# EAGLE design CO2-Ampel-Pro_v12 (EAGLE 7.7.0)
Assembly variants: light

## Sheet 1 of 3
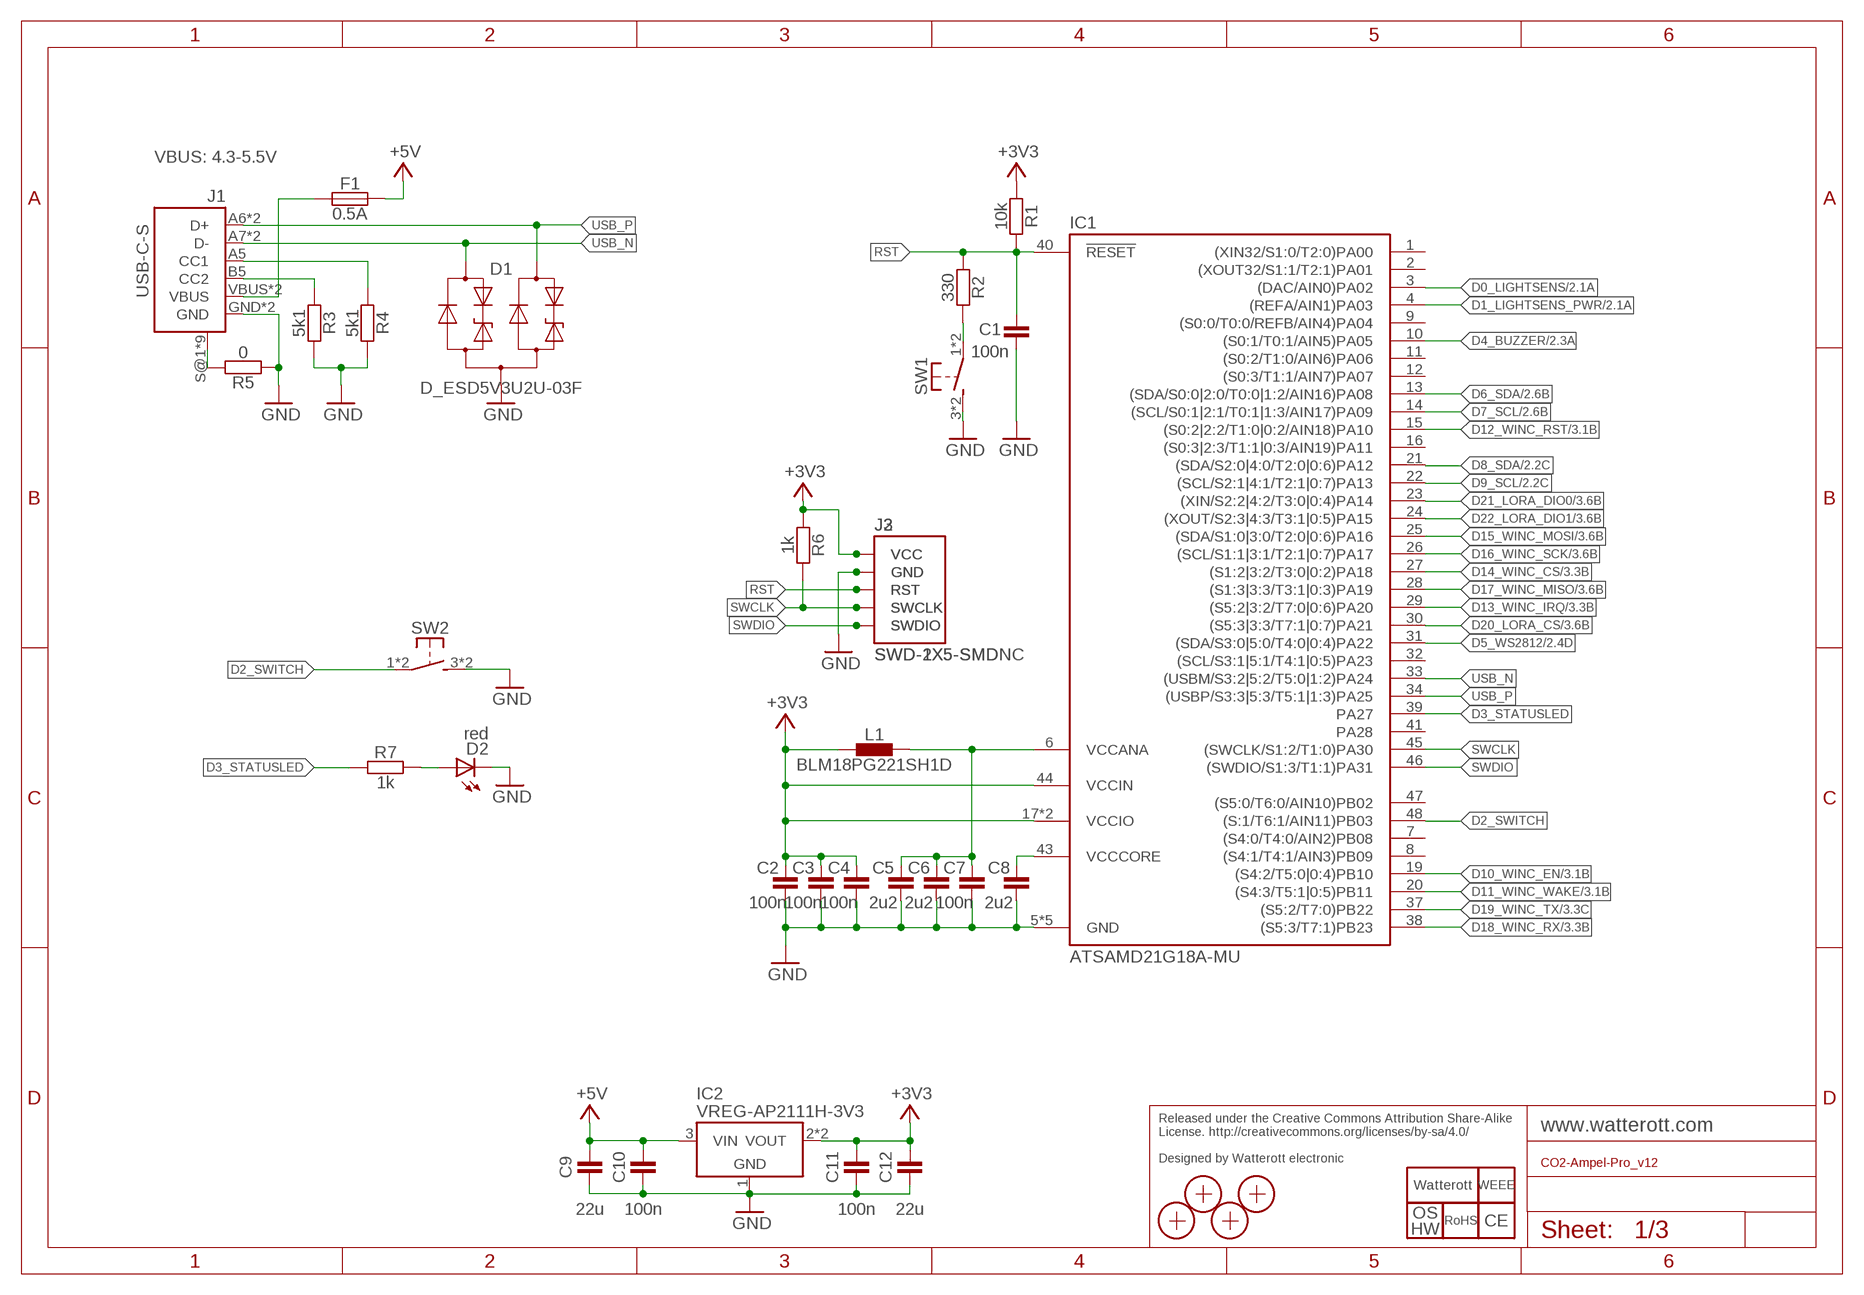
[diagram p0: schematic, sheet 1]

### Parts
C1  100n  CAPACITOR-0402  [C0402]
C2  100n  CAPACITOR-0402  [C0402]
C3  100n  CAPACITOR-0402  [C0402]
C4  100n  CAPACITOR-0402  [C0402]
C5  2u2  CAPACITOR-0402  [C0402]
C6  2u2  CAPACITOR-0402  [C0402]
C7  100n  CAPACITOR-0402  [C0402]
C8  2u2  CAPACITOR-0402  [C0402]
C9  22u  CAPACITOR-0805  [C0805]
C10  100n  CAPACITOR-0402  [C0402]
C11  100n  CAPACITOR-0402  [C0402]
C12  22u  CAPACITOR-0805  [C0805]
D1  D_ESD5V3U2U-03F  [SOT723]
D2  red  LED-0603  [C0603]
F1  0.5A  FUSE-0805  [C0805]
IC1  ATSAMD21G18A-MU  [QFN48-PAD]
IC2  VREG-AP2111H-3V3  VREG-TS1117CW-3V3  [SOT223]
J1  USB-C-S  [USB-C-S]
J2  SWD-2X5-SMD  [SWD-2X5_SMD]  (not fitted in variant light)
J3  SWD-1X5-SMDNC  [SWD-1X5_SMDNC]
L1  BLM18PG221SH1D  INDUCTOR-0603  [C0603]
LOGO1  LOGO_SPARK-4  [SPARK_4MM]
LOGO2  LOGO_WEEE-4  [WEEE_4MM]
LOGO3  OSHW_LOGOX0070  LOGO_OSHW-3  [OSHW_3MM]
LOGO4  LOGO_ROHS-4  [ROHS_4MM]
LOGO5  LOGO_CE-4  [CE_4MM]
R1  10k  RESISTOR-0402  [C0402]
R2  330  RESISTOR-0402  [C0402]
R3  5k1  RESISTOR-0402  [C0402]
R4  5k1  RESISTOR-0402  [C0402]
R5  0  RESISTOR-0603  [C0603]
R6  1k  RESISTOR-0402  [C0402]
R7  1k  RESISTOR-0402  [C0402]
SW1  PTS645SK50SMTR92-Red  SW-TACTILE-PTS840P  [PTS840P]
SW2  PTS645SH50SMTR92-Grey  SW-TACTILE-PTS840P  [PTS840P]  (not fitted in variant light)
X1  PASSER-07  [PASSER_07MM]
X2  PASSER-07  [PASSER_07MM]
X3  PASSER-07  [PASSER_07MM]
X4  PASSER-07  [PASSER_07MM]

### Nets
+3V3: C2.2 C3.2 C4.2 C11.2 C12.2 IC1.17(VCCIO) IC1.36(VCCIO) IC1.44(VCCIN) IC2.2(VOUT) IC2.4(VOUT) J2.VCC J3.1-VCC(VCC) L1.1 R1.1 R6.1 ; also sheet 2,3
+5V: C9.2 C10.2 F1.2 IC2.3(VIN) ; also sheet 2
CC1: J1.A5(CC1) R4.1
CC2: J1.B5(CC2) R3.1
D0_LIGHTSENS: IC1.3((DAC/AIN0)PA02) ; also sheet 2
D1_LIGHTSENS_PWR: IC1.4((REFA/AIN1)PA03) ; also sheet 2
D2_SWITCH: IC1.48((S:1/T6:1/AIN11)PB03) SW2.1 SW2.2(P1)
D3_STATUSLED: IC1.39(PA27) R7.1
D4_BUZZER: IC1.10((S0:1/T0:1/AIN5)PA05) ; also sheet 2
D5_WS2812: IC1.31((SDA/S3:0|5:0/T4:0|0:4)PA22) ; also sheet 2
D6_SDA: IC1.13((SDA/S0:0|2:0/T0:0|1:2/AIN16)PA08) ; also sheet 2
D7_SCL: IC1.14((SCL/S0:1|2:1/T0:1|1:3/AIN17)PA09) ; also sheet 2
D8_SDA: IC1.21((SDA/S2:0|4:0/T2:0|0:6)PA12) ; also sheet 2
D9_SCL: IC1.22((SCL/S2:1|4:1/T2:1|0:7)PA13) ; also sheet 2
D10_WINC_EN: IC1.19((S4:2/T5:0|0:4)PB10) ; also sheet 3
D11_WINC_WAKE: IC1.20((S4:3/T5:1|0:5)PB11) ; also sheet 3
D12_WINC_RST: IC1.15((S0:2|2:2/T1:0|0:2/AIN18)PA10) ; also sheet 3
D13_WINC_IRQ: IC1.29((S5:2|3:2/T7:0|0:6)PA20) ; also sheet 3
D14_WINC_CS: IC1.27((S1:2|3:2/T3:0|0:2)PA18) ; also sheet 3
D15_WINC_MOSI: IC1.25((SDA/S1:0|3:0/T2:0|0:6)PA16) ; also sheet 3
D16_WINC_SCK: IC1.26((SCL/S1:1|3:1/T2:1|0:7)PA17) ; also sheet 3
D17_WINC_MISO: IC1.28((S1:3|3:3/T3:1|0:3)PA19) ; also sheet 3
D18_WINC_RX: IC1.38((S5:3/T7:1)PB23) ; also sheet 3
D19_WINC_TX: IC1.37((S5:2/T7:0)PB22) ; also sheet 3
D20_LORA_CS: IC1.30((S5:3|3:3/T7:1|0:7)PA21) ; also sheet 3
D21_LORA_DIO0: IC1.23((XIN/S2:2|4:2/T3:0|0:4)PA14) ; also sheet 3
D22_LORA_DIO1: IC1.24((XOUT/S2:3|4:3/T3:1|0:5)PA15) ; also sheet 3
GND: C1.1 C2.1 C3.1 C4.1 C5.1 C6.1 C7.1 C8.1 C9.1 C10.1 C11.1 C12.1 D1.3(A) D2.C IC1.5(GND) IC1.18(GND) IC1.35(GND) IC1.42(GND) IC1.TP(GND) IC2.1(GND) J1.GND J1.GND2(GND) J2.GND@1(GND) J2.GND@2(GND) J2.GND@3(GND) J3.2-GND(GND) R3.2 R4.2 R5.1 SW1.3(S1) SW1.4(S1) SW2.3(S1) SW2.4(S1) ; also sheet 2,3
N$3: D2.A R7.2
N$8: R2.2 SW1.1 SW1.2(P1)
RST: C1.2 IC1.40(!RESET) J2.RST J3.3-RST(RST) R1.2 R2.1
SHLD: J1.S@1(SHIELD) J1.S@2(SHIELD) J1.S@3(SHIELD) J1.S@4(SHIELD) J1.S@5(SHIELD) J1.S@6(SHIELD) J1.S@7(SHIELD) J1.S@8(SHIELD) J1.S@9(SHIELD) R5.2
SWCLK: IC1.45((SWCLK/S1:2/T1:0)PA30) J2.SWCLK J3.4-SWDCLK(SWCLK) R6.2
SWDIO: IC1.46((SWDIO/S1:3/T1:1)PA31) J2.SWDIO J3.5-SWDIO(SWDIO)
USB_N [USB]: D1.1(C1) IC1.33((USBM/S3:2|5:2/T5:0|1:2)PA24) J1.A7(D-) J1.B7(D-)
USB_P [USB]: D1.2(C2) IC1.34((USBP/S3:3|5:3/T5:1|1:3)PA25) J1.A6(D+) J1.B6(D+)
VBUS: F1.1 J1.VBUS J1.VBUS2(VBUS)
VCCANA: C5.2 C6.2 C7.2 IC1.6(VCCANA) L1.2
VCCCORE: C8.2 IC1.43(VCCCORE)
Unconnected: IC1.1((XIN32/S1:0/T2:0)PA00) IC1.2((XOUT32/S1:1/T2:1)PA01) IC1.7((S4:0/T4:0/AIN2)PB08) IC1.8((S4:1/T4:1/AIN3)PB09) IC1.9((S0:0/T0:0/REFB/AIN4)PA04) IC1.11((S0:2/T1:0/AIN6)PA06) IC1.12((S0:3/T1:1/AIN7)PA07) IC1.16((S0:3|2:3/T1:1|0:3/AIN19)PA11) IC1.32((SCL/S3:1|5:1/T4:1|0:5)PA23) IC1.41(PA28) IC1.47((S5:0/T6:0/AIN10)PB02)

### Notes on the sheet
- VBUS: 4.3-5.5V
- Released under the Creative Commons Attribution Share-Alike
  License. http://creativecommons.org/licenses/by-sa/4.0/
  
  Designed by Watterott electronic

## Sheet 2 of 3
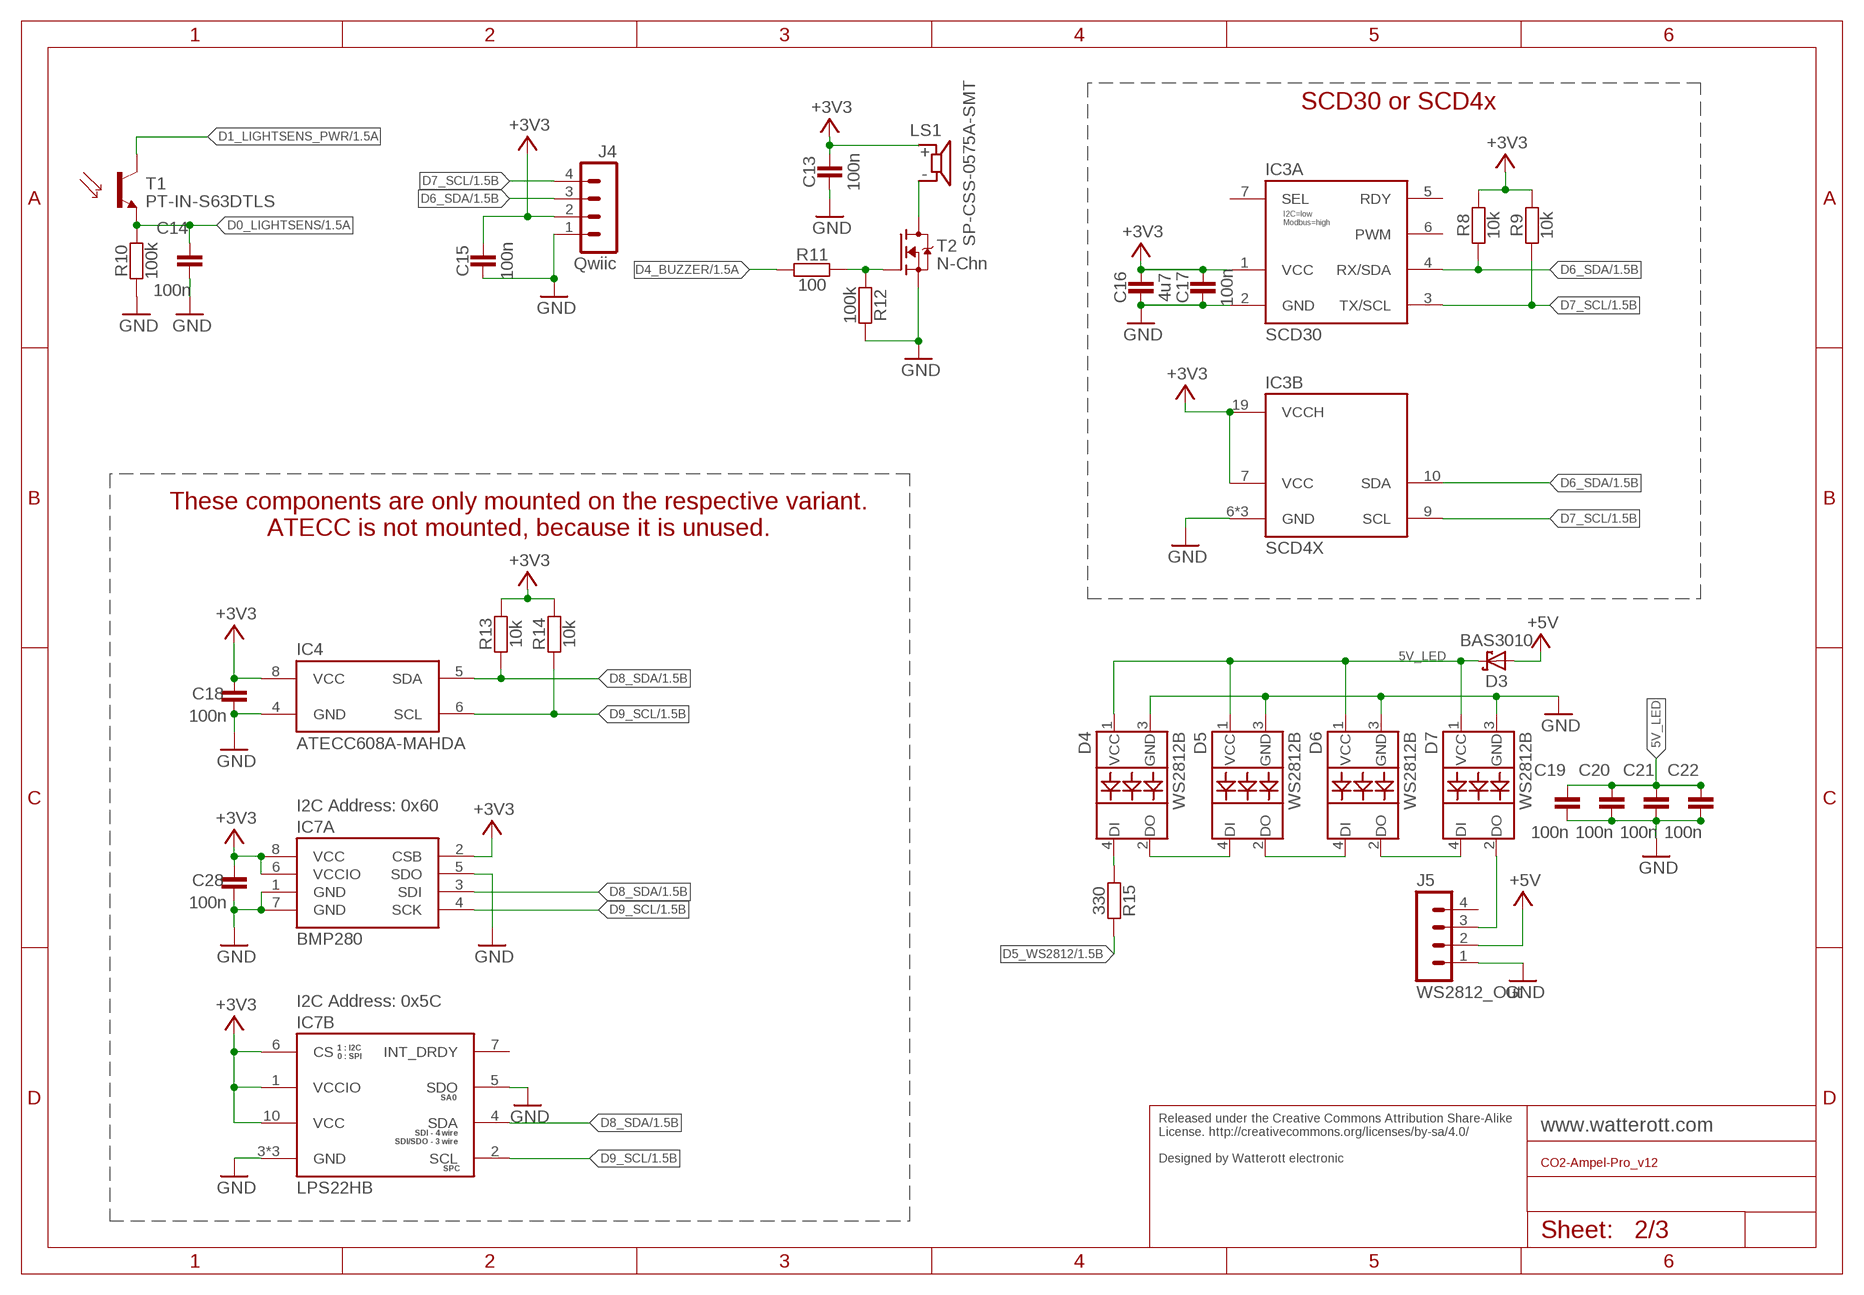
[diagram p1: schematic, sheet 2]

### Parts
C13  100n  CAPACITOR-0402  [C0402]
C14  100n  CAPACITOR-0402  [C0402]
C15  100n  CAPACITOR-0402  [C0402]
C16  4u7  CAPACITOR-0402  [C0402]
C17  100n  CAPACITOR-0402  [C0402]
C18  100n  CAPACITOR-0402  [C0402]
C19  100n  CAPACITOR-0402  [C0402]
C20  100n  CAPACITOR-0402  [C0402]
C21  100n  CAPACITOR-0402  [C0402]
C22  100n  CAPACITOR-0402  [C0402]
C28  100n  CAPACITOR-0402  [C0402]
D3  BAS3010  D_SCHOTTKY-SOD323  [SOD323]
D4  WS2812B  [WS2812B]
D5  WS2812B  [WS2812B]
D6  WS2812B  [WS2812B]
D7  WS2812B  [WS2812B]
IC3A  SCD30  [SCD30]
IC3B  SCD4X  [SCD4X]
IC4  ATECC608A-MAHDA  [UDFN8]
IC7A  BMP280  [LGA8]
IC7B  LPS22HB  [LPS22HB]
J4  Qwiic  JST4-SM04B-SRSS-TB  [JST_SM04B-SRSS-TB]
J5  WS2812_Out  JST4-SM04B-SRSS-TB  [JST_SM04B-SRSS-TB]
LS1  SP-CSS-0575A-SMT  [CUI_CSS-0575A-SMT]
R8  10k  RESISTOR-0402  [C0402]
R9  10k  RESISTOR-0402  [C0402]
R10  100k  RESISTOR-0402  [C0402]
R11  100  RESISTOR-0402  [C0402]
R12  100k  RESISTOR-0402  [C0402]
R13  10k  RESISTOR-0402  [C0402]
R14  10k  RESISTOR-0402  [C0402]
R15  330  RESISTOR-0402  [C0402]
T1  PT-IN-S63DTLS  [C0603T]
T2  N-Chn  MOSFET-N-SOT23  [SOT23]

### Nets
5V_LED: C19.2 C20.2 C21.2 C22.2 D3.C D4.1(VCC) D5.1(VCC) D6.1(VCC) D7.1(VCC)
+3V3: C13.2 C15.2 C16.2 C17.2 C18.2 C28.2 IC3A.1(VCC) IC3B.7(VCC) IC3B.19(VCCH) IC4.8(VCC) IC7A.2(CSB) IC7A.6(VCCIO) IC7A.8(VCC) IC7B.1(VCCIO) IC7B.6(CS) IC7B.10(VCC) J4.2 LS1.+(P) R8.2 R9.2 R13.2 R14.2 ; also sheet 1,3
+5V: D3.A J5.2 ; also sheet 1
D0_LIGHTSENS: C14.2 R10.2 T1.E ; also sheet 1
D1_LIGHTSENS_PWR: T1.C ; also sheet 1
D4_BUZZER: R11.1 ; also sheet 1
D5_WS2812: R15.2 ; also sheet 1
D6_SDA: IC3A.4(RX/SDA) IC3B.10(SDA) J4.3 R8.1 ; also sheet 1
D7_SCL: IC3A.3(TX/SCL) IC3B.9(SCL) J4.4 R9.1 ; also sheet 1
D8_SDA: IC4.5(SDA) IC7A.3(SDI) IC7B.4(SDA) R13.1 ; also sheet 1
D9_SCL: IC4.6(SCL) IC7A.4(SCK) IC7B.2(SCL) R14.1 ; also sheet 1
GND: C13.1 C14.1 C15.1 C16.1 C17.1 C18.1 C19.1 C20.1 C21.1 C22.1 C28.1 D4.3(GND) D5.3(GND) D6.3(GND) D7.3(GND) IC3A.2(GND) IC3B.6(GND) IC3B.20(GND) IC3B.21(GND) IC4.4(GND) IC7A.1(GND) IC7A.5(SDO) IC7A.7(GND) IC7B.3(GND) IC7B.5(SDO) IC7B.8(GND) IC7B.9(GND) J4.1 J5.1 R10.1 R12.2 T2.2(S) ; also sheet 1,3
N$1: LS1.-(N) T2.3(D)
N$2: R11.2 R12.1 T2.1(G)
W1IN: D4.4(DI) R15.1
W1OUT: D4.2(DO) D5.4(DI)
W2OUT: D5.2(DO) D6.4(DI)
W3OUT: D6.2(DO) D7.4(DI)
W4OUT: D7.2(DO) J5.3
Unconnected: IC3A.5(RDY) IC3A.6(PWM) IC3A.7(SEL) IC7B.7(INT_DRDY) J5.4

### Notes on the sheet
- SCD30 or SCD4x
- These components are only mounted on the respective variant.
  ATECC is not mounted, because it is unused.
- I2C Address: 0x60
- I2C Address: 0x5C
- Released under the Creative Commons Attribution Share-Alike
  License. http://creativecommons.org/licenses/by-sa/4.0/
  
  Designed by Watterott electronic

## Sheet 3 of 3
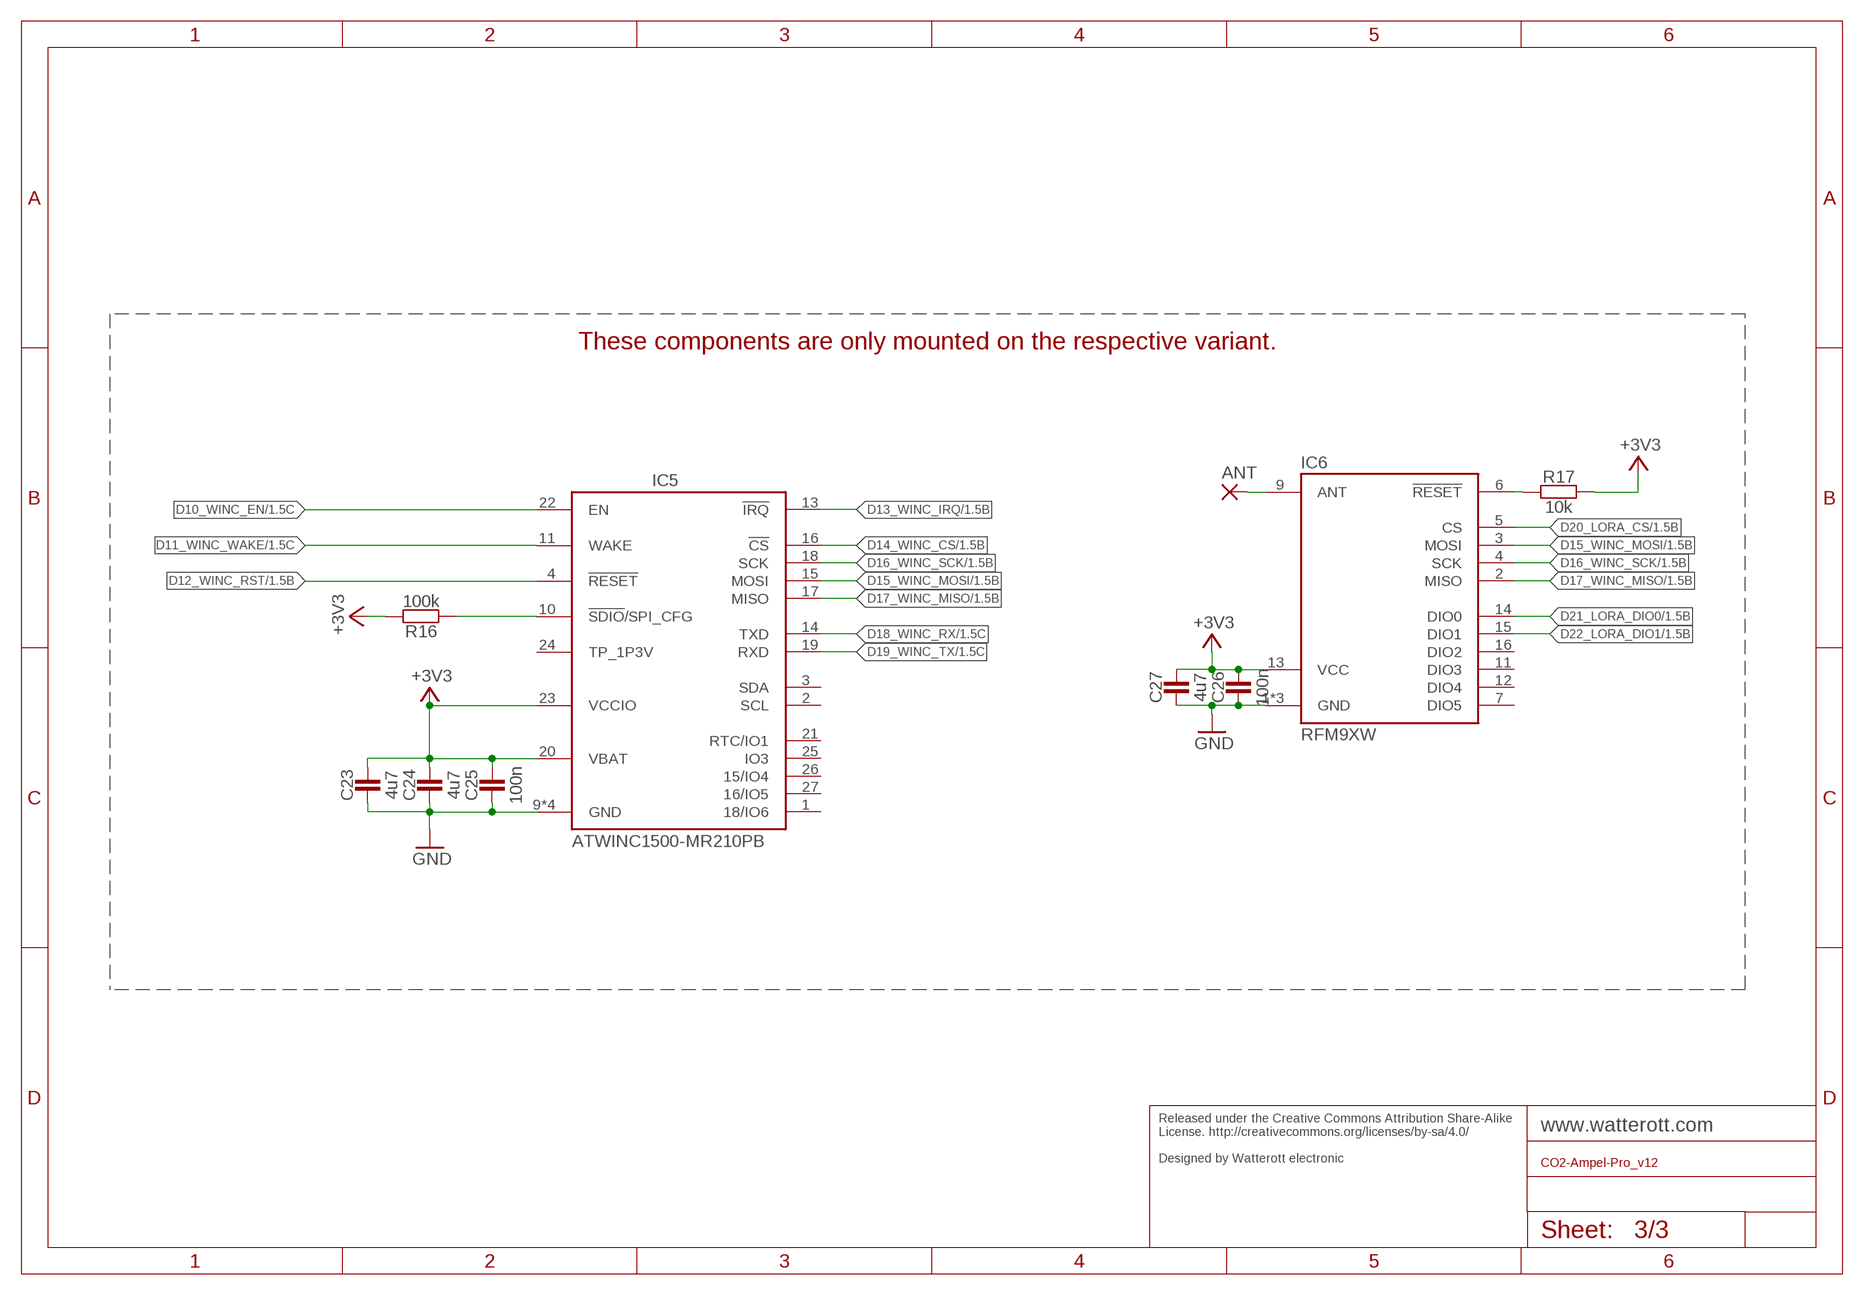
[diagram p2: schematic, sheet 3]

### Parts
ANT  1,6/0,9  [1,6/0,9]
C23  4u7  CAPACITOR-0402  [C0402]
C24  4u7  CAPACITOR-0402  [C0402]
C25  100n  CAPACITOR-0402  [C0402]
C26  100n  CAPACITOR-0402  [C0402]
C27  4u7  CAPACITOR-0402  [C0402]
IC5  ATWINC1500-MR210PB  [ATWINC1500-MX210]
IC6  RFM9XW  [RFM9X]
R16  100k  RESISTOR-0402  [C0402]
R17  10k  RESISTOR-0402  [C0402]

### Nets
+3V3: C23.2 C24.2 C25.2 C26.2 C27.2 IC5.20(VBAT) IC5.23(VCCIO) IC6.13(VCC) R16.2 R17.2 ; also sheet 1,2
CFG: IC5.10(!SDIO!/SPI_CFG) R16.1
D10_WINC_EN: IC5.22(EN) ; also sheet 1
D11_WINC_WAKE: IC5.11(WAKE) ; also sheet 1
D12_WINC_RST: IC5.4(!RESET) ; also sheet 1
D13_WINC_IRQ: IC5.13(!IRQ) ; also sheet 1
D14_WINC_CS: IC5.16(!CS) ; also sheet 1
D15_WINC_MOSI: IC5.15(MOSI) IC6.3(MOSI) ; also sheet 1
D16_WINC_SCK: IC5.18(SCK) IC6.4(SCK) ; also sheet 1
D17_WINC_MISO: IC5.17(MISO) IC6.2(MISO) ; also sheet 1
D18_WINC_RX: IC5.14(TXD) ; also sheet 1
D19_WINC_TX: IC5.19(RXD) ; also sheet 1
D20_LORA_CS: IC6.5(CS) ; also sheet 1
D21_LORA_DIO0: IC6.14(DIO0) ; also sheet 1
D22_LORA_DIO1: IC6.15(DIO1) ; also sheet 1
GND: C23.1 C24.1 C25.1 C26.1 C27.1 IC5.9(GND) IC5.12(GND) IC5.28(GND) IC5.GND IC6.1(GND) IC6.8(GND) IC6.10(GND) ; also sheet 1,2
N$4: ANT.1(P) IC6.9(ANT)
N$6: IC6.6(!RESET) R17.1
Unconnected: IC5.1(18/IO6) IC5.2(SCL) IC5.3(SDA) IC5.21(RTC/IO1) IC5.24(TP_1P3V) IC5.25(IO3) IC5.26(15/IO4) IC5.27(16/IO5) IC6.7(DIO5) IC6.11(DIO3) IC6.12(DIO4) IC6.16(DIO2)

### Notes on the sheet
- These components are only mounted on the respective variant.
- Released under the Creative Commons Attribution Share-Alike
  License. http://creativecommons.org/licenses/by-sa/4.0/
  
  Designed by Watterott electronic

## Library data of the parts
ANT = wirepad:1,6/0,9: THROUGH-HOLE PAD
C1-C28 = we-rcl:CAPACITOR: Capacitor ...2.2uF @ 6.3V -> 0402 ...4.7uF @ 6.3V -> 0603 ...10uF @ 16V -> 0805 ...22uF @ 25V -> 1206
D1 = we-rcl:D_ESD5V3U2U: ESD5V3U2U TVS Diode (Uni-directional Ultra Low ESD) Vrwm=5.3V, 0.4pF@1MHz; DIGIKEY: ESD5V3U2U-03F H6327DKR-ND
D2 = we-opto:LED: LED red, green, blue -> 0603
D3 = we-rcl@1:D_SCHOTTKY: Schottky Diode 1A, 30V - SOD323 (BAS3010B) 3A, 100V - SOD123 (S310A)
D4-D7 = we-opto:WS2812B: WS2812 RGB LED (built-in driver)
F1 = we-rcl:FUSE: Fuse Polyfuses 0805 - 0.5A or 1A, 6V 1206 - 2A, 6V 1812 - 1A or 2A, 16V
IC1 = we-chip:ATSAMD21G: Microchip ATSAMD21Gxx ARM Cortex-M0+ (48 pin) ...18 - 256kb Flash 32kb RAM ...17 - 128kb Flash 16kb RAM ...16 - 64kb Flash 8kb RAM ...15 - 32kb Flash 4kb RAM
IC2 = we-power:VREG: Voltage Regulator LDOs Taiwan Semi TS1117 800mA max 15V - compatible On Semi NCP1117 1A max 20V - compatible Diodes AP2111H 0.6A max 6V (0.25V@0.6A) - compatible Diodes AP2114H 1A max 6V (0.45V@1A) Taiwan Semi TS9011 250mA max 12V - compatible Diodes AP2210 300mA max 15V - compatible Microchip MCP1700 250mA max 6.5V - compatible Microchip MCP1702 250mA max 13V - compatible Microchip MCP1703 250mA max 16V - compatible Microchip MCP1754 150mA max 16V Taiwan Semi TS5204 80mA max 16V (low noise) DC/DC Converter Modules Recom R-78Ex.x-1.0-W36 1A max 28V - compatible CUI V78xx-2000 2A max 18V Murata OKI-78SR-x.x/1.5-W36 1.5A max 36V
IC3A = we-sensor:SCD30: Sensirion SCD30 CO2, Humidity, Temperature Sensor
IC3B = we-sensor@1:SCD4X: Sensirion SCD4x CO2 Sensor
IC4 = we-chip:ATECC608A: Microchip ATECC508A/ATECC608A Crypto-Authentication Device ATECC508A - RNG, ECC P256 (ECDH and ECDSA), SHA256 ATECC608A - RNG, ECC P256 (ECDH and ECDSA), SHA256, AES-CCM
IC5 = we-chip:ATWINC1500: Microchip ATWINC1500 WiFi/WLAN 802.11 b/g/n MR210PB - PCB antenna MR210UB - uFL connector WINC1500 - 4Mb Flash WINC1510 - 8Mb Flash
IC6 = we-chip:RFM9X: HopeRF RFM9xW LoRa Module RFM95W 868/915 MHz (SX1276 compatible) RFM96W 433/470 MHz (SX1276 compatible)
IC7A = we-sensor@1:BMP280: Bosch BMP280 Temperature, Pressure Sensor
IC7B = we-sensor@1:LPS22HB: MEMS nano pressure sensor: 260-1260 hPa absolute
J1 = we-con:USB-C: USB-C Connector Hroparts TYPE-C-31-M-12 or Jing C167321 or XKB U262-161N-4BVC11 Up: XKB U263-241N-4BQC11-1 or Wuerth 632722110112
J2 J3 = we-board:SWD: SWD connector
J4 J5 = we-con:JST4: JST Connector
L1 = we-rcl:INDUCTOR: Inductor Ferrite Bead - Murata BLM18PG 0603 3.0A 33Ohm @ 100MH -> BLM18PG330SN1D 0603 2.0A 120Ohm @ 100MH -> BLM18PG121SN1D 0603 1.4A 220Ohm @ 100MH -> BLM18PG221SH1D 0603 1.2A 330Ohm @ 100MH -> BLM18PG331SN1D 0603 1.0A 470Ohm @ 100MH -> BLM18PG471SN1D
LOGO1 = we-symbol:LOGO_SPARK: Watterott electronic Logo
LOGO2 = we-symbol:LOGO_WEEE: WEEE Logo
LOGO3 = we-symbol:LOGO_OSHW: Open-Source-Hardware Logo
LOGO4 = we-symbol:LOGO_ROHS: RoHS Logo
LOGO5 = we-symbol:LOGO_CE: CE Logo
LS1 = we-audio:SP: Speaker/Buzzer CUI CSS-0575A-SMT (3V, 75dB); MF: CUI; MPN: CSS-0575A-SMT
R1-R17 = we-rcl:RESISTOR: Resistor all kinds in 0402 and 0603
SW1 SW2 = we-switch:SW-TACTILE: Tactile Switche; DIGIKEY: CKN10511DKR-ND
T1 = we-opto:PT: Phototransistor
T2 = we-transistor:MOSFET-N: N-Chn MOSFET SOT23 N-Chn MOSFET TSM3404, TSM240N03 (Vgs>=+/-20V, Vds<=30V, Id>=3A + Rds<=0.05Ohm @ Vgs=4.5V) BSS138 (Vgs>=+/-20V, Vds<=40V, Id>=0.2A + Rds<=3Ohm @ Vgs=4.5V) SOT223 Low Side Switch with Protection (Infineon) BSP76 (Vin=0...10V, Vds<=42V, Id=1.4A + Rds=0.2Ohm @ Vin=5V) BSP77 (Vin=0...10V, Vds<=42V, Id=2.2A + Rds=0.1Ohm @ Vin=5V) D²Pak Low Side Switch with Protection (Infineon) BTS117TC (Vin=0...10V, Vds<=60V, Id=3.5A + Rds=0.12Ohm @ Vin=5V) BTS133TC (Vin=0...10V, Vds<=60V, Id=7A + Rds=0.06Ohm @ Vin=5V) BTS141TC (Vin=0...10V, Vds<=60V, Id=12A + Rds=0.03Ohm @ Vin=5V) BTS3018TC (Vin=0...10V, Vds<=60V, Id=6A + Rds=0.02Ohm @ Vin=5V)
X1-X4 = we-symbol:PASSER: Fiducial Marker

## Net classes
1 USB: width 0.203 mm, clearance 0.152 mm

## Board
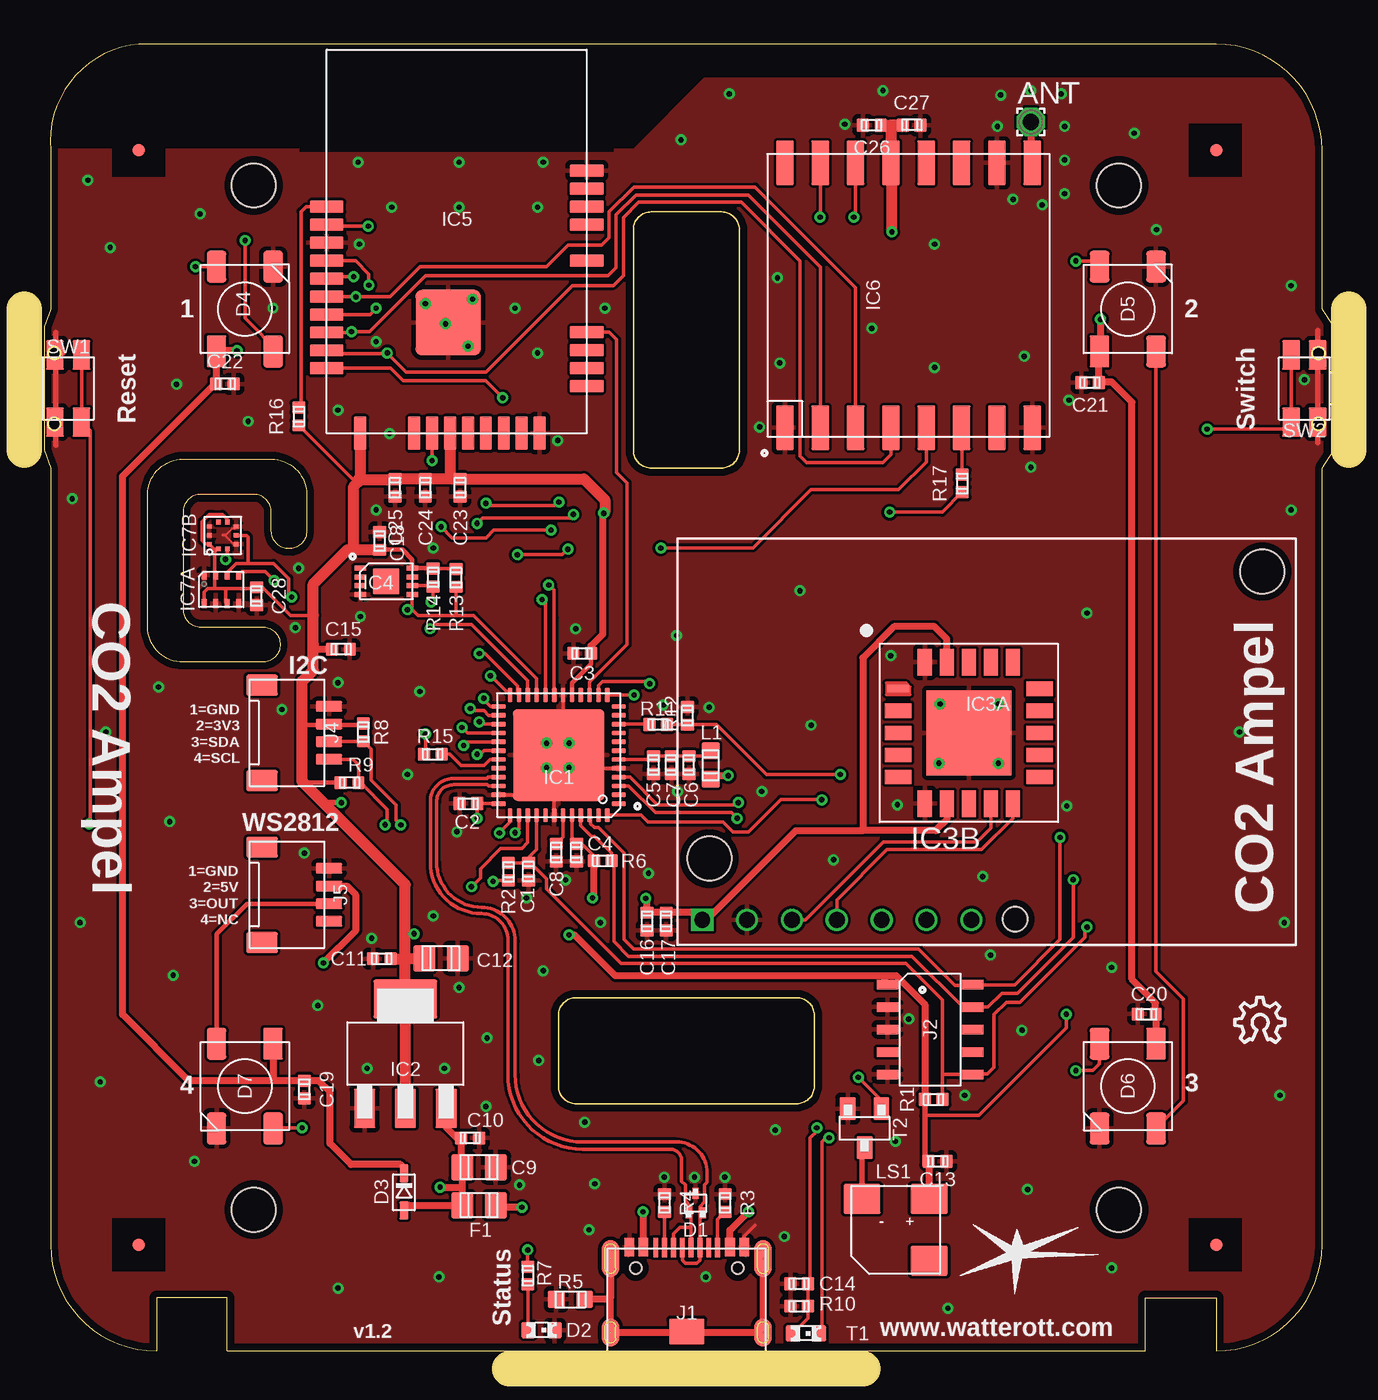
[diagram p3: board, top side]
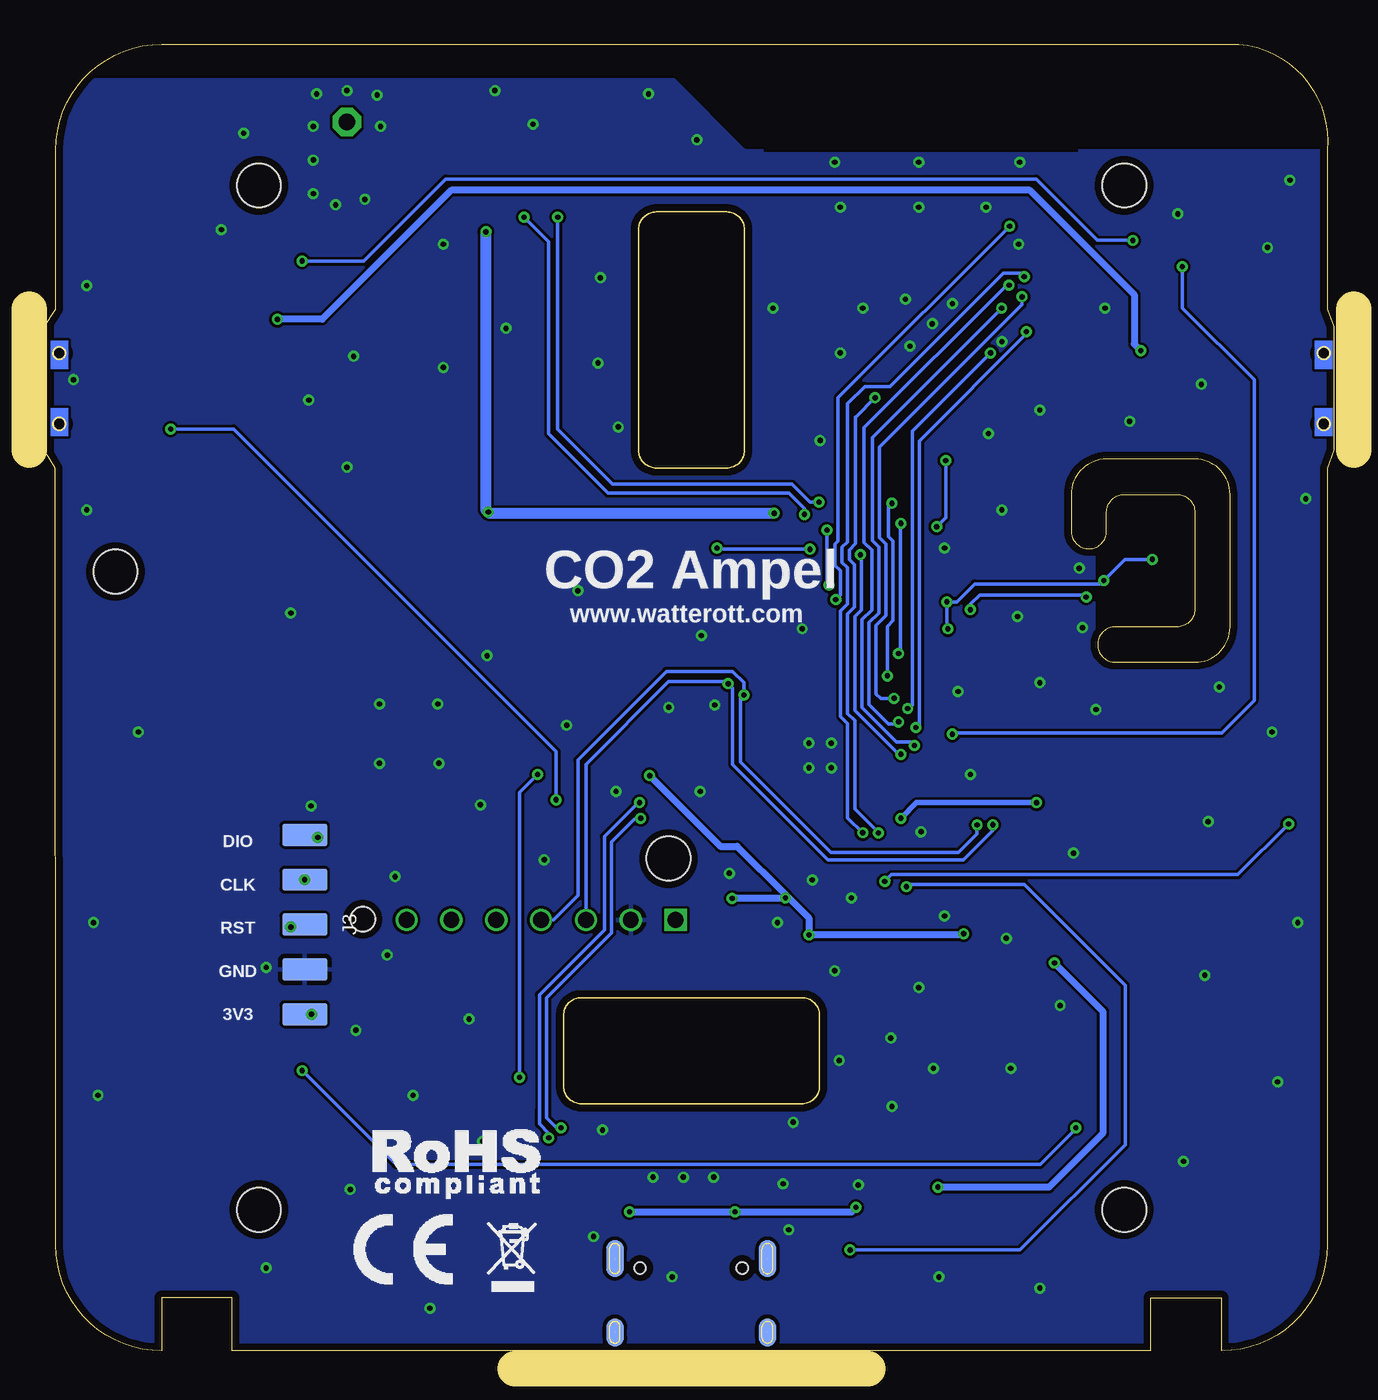
[diagram p4: board, bottom side, seen from below]

Size 73.02 x 74 mm. Coordinates in mm from the lower left corner, seen from the top.
Outline: 10.37,0 62.37,0 62.37,3 66.36,3 66.36,0 arc90 72.36,6 72.39,50 73.02,51 73.02,58 72.36,59 72.36,68 arc90 66.36,74 5.37,74 arc90 0.36,68 0.36,59 0,58 0,51 0.36,50 0.36,6 arc90 6.37,0 6.37,3 10.37,3 10.37,0
Outline: 33.37,63.5 33.37,51 arc90 34.37,50 38.37,50 arc90 39.37,51 39.37,63.5 arc90 38.37,64.5 34.37,64.5 arc90 33.37,63.5
Outline: 30.11,14 42.62,14 arc90 43.62,15 43.62,19 arc90 42.62,20 30.11,20 arc90 29.11,19 29.11,15 arc90 30.11,14
Outline: 12.37,41 arc-90 13.37,40 arc-90 12.37,39 7.87,39 arc-90 5.87,41 5.87,48.5 arc-90 7.87,50.5 12.87,50.5 arc-90 14.87,48.5 14.87,46.43 arc-90 13.87,45.43 arc-90 12.87,46.43 12.87,47.5 arc90 11.87,48.5 8.87,48.5 arc90 7.87,47.5 7.87,42 arc90 8.87,41 12.37,41
Copper layers (1*16): Top 0.035mm / dielectric 1.5mm / Bottom 0.035mm
Design rules "we-dru-2-layer *": minimum track width 6mil, minimum drill 0.3mm, track to track 6mil, track to pad 7mil, pad to pad 8mil, via to via 8mil, smd to smd 4mil, copper to edge 0.4mm, drill to drill 0.4mm, minimum pad ring 0.18mm, minimum via ring 0.16mm, stop-mask expansion 0.1mm, vias tented up to drill 0.5mm, thermal gap 0.25mm
Holes 1.4 mm at 54.98,24.45
Holes 2.5 mm at 11.87,8 60.87,8 60.87,66 11.87,66
tRestrict: area 3.9,66.5 to 6.9,69.5; area 64.8,66.5 to 67.8,69.5; area 3.9,4.5 to 6.9,7.5; area 64.8,4.5 to 67.8,7.5
bRestrict: 1 lines
Milling: 3 lines

### Footprints (pad centres in the part's own frame; a part is rotated, then mirrored left to right if it is on the bottom)
1,6/0,9 = drill 0.914 pad 1.6 octagon: 1 0,0
C0402 = smd 0.75 x 0.7: 1 0,0.5; 2 0,-0.5
C0805 = smd 1.5 x 1.25: 1 0,0.95; 2 0,-0.95
SOT723 = smd 0.6 x 0.4: 1 -0.55,0.4; 2 -0.55,-0.4; 3 0.55,0
C0603 = smd 0.9 x 0.8: A 0,-0.75; C 0,0.75
SOD323 = smd 0.5 x 1: A 0,-1.05; C 0,1.05
WS2812B = smd 1.8 x 1.1: 1 -2.4,1.6; 2 -2.4,-1.6; 3 2.4,-1.6; 4 2.4,1.6
QFN48-PAD = smd 0.8 x 0.26: 1 -3.4,2.75; 2 -3.4,2.25; 3 -3.4,1.75; 4 -3.4,1.25; 5 -3.4,0.75; 6 -3.4,0.25; 7 -3.4,-0.25; 8 -3.4,-0.75; 9 -3.4,-1.25; 10 -3.4,-1.75; 11 -3.4,-2.25; 12 -3.4,-2.75; 25 3.4,-2.75; 26 3.4,-2.25; 27 3.4,-1.75; 28 3.4,-1.25; 29 3.4,-0.75; 30 3.4,-0.25; 31 3.4,0.25; 32 3.4,0.75; 33 3.4,1.25; 34 3.4,1.75; 35 3.4,2.25; 36 3.4,2.75 | smd 0.26 x 0.8: 13 -2.75,-3.4; 14 -2.25,-3.4; 15 -1.75,-3.4; 16 -1.25,-3.4; 17 -0.75,-3.4; 18 -0.25,-3.4; 19 0.25,-3.4; 20 0.75,-3.4; 21 1.25,-3.4; 22 1.75,-3.4; 23 2.25,-3.4; 24 2.75,-3.4; 37 2.75,3.4; 38 2.25,3.4; 39 1.75,3.4; 40 1.25,3.4; 41 0.75,3.4; 42 0.25,3.4; 43 -0.25,3.4; 44 -0.75,3.4; 45 -1.25,3.4; 46 -1.75,3.4; 47 -2.25,3.4; 48 -2.75,3.4 | smd 5.2 x 5.2: TP 0,0
SOT223 = smd 2.235 x 1.219: 1 -3.099,2.311; 2 -3.099,0; 3 -3.099,-2.311 | smd 2.2 x 3.6: 4 3.099,0
SCD30 = drill 0.9 square: 1 -16.1,-10.09 | drill 0.9: 2 -13.56,-10.09; 3 -11.02,-10.09; 4 -8.48,-10.09; 5 -5.94,-10.09; 6 -3.4,-10.09; 7 -0.86,-10.09 | hole 2.5: -15.7,-6.62; 15.62,9.64
SCD4X = smd 1.2 x 0.4: 1 -4,2.5 | smd 1.5 x 0.8: 2 -4,1.25; 3 -4,0; 4 -4,-1.25; 5 -4,-2.5; 11 4,-2.5; 12 4,-1.25; 13 4,0; 14 4,1.25; 15 4,2.5 | smd 0.8 x 1.5: 6 -2.5,-4; 7 -1.25,-4; 8 0,-4; 9 1.25,-4; 10 2.5,-4; 16 2.5,4; 17 1.25,4; 18 0,4; 19 -1.25,4; 20 -2.5,4 | smd 4.8 x 4.8: 21 0,0
UDFN8 = smd 0.7 x 0.28: 1 -1.475,0.75; 2 -1.475,0.25; 3 -1.475,-0.25; 4 -1.475,-0.75; 5 1.475,-0.75; 6 1.475,-0.25; 7 1.475,0.25; 8 1.475,0.75 | smd 1.5 x 1.5: TP 0,0
ATWINC1500-MX210 = smd 1.9 x 0.7: 1 7.365,-8.19; 2 7.365,-7.174; 3 7.365,-6.158; 4 7.365,-5.142; 5 7.365,-1.078; 6 7.365,0.954; 7 7.365,1.97; 8 7.365,2.986; 9 7.365,4.002; 10 -7.365,1.964; 11 -7.365,0.948; 12 -7.365,-0.068; 13 -7.365,-1.084; 14 -7.365,-2.1; 15 -7.365,-3.116; 16 -7.365,-4.132; 17 -7.365,-5.148; 18 -7.365,-6.164; 19 -7.365,-7.18 | smd 0.7 x 1.9: 20 -5.465,-10.86; 21 -2.417,-10.86; 22 -1.401,-10.86; 23 -0.385,-10.86; 24 0.631,-10.86; 25 1.647,-10.86; 26 2.663,-10.86; 27 3.679,-10.86; 28 4.695,-10.86 | smd 3.7 x 3.7: GND -0.485,-4.59
RFM9X = smd 2.5 x 1: 1 -7.5,7; 2 -7.5,5; 3 -7.5,3; 4 -7.5,1; 5 -7.5,-1; 6 -7.5,-3; 7 -7.5,-5; 8 -7.5,-7; 9 7.5,-7; 10 7.5,-5; 11 7.5,-3; 12 7.5,-1; 13 7.5,1; 14 7.5,3; 15 7.5,5; 16 7.5,7
LGA8 = smd 0.5 x 0.35: 1 0.8,0.975; 2 0.8,0.325; 3 0.8,-0.325; 4 0.8,-0.975; 5 -0.8,-0.975; 6 -0.8,-0.325; 7 -0.8,0.325; 8 -0.8,0.975
LPS22HB = smd 0.275 x 0.25: 1 -0.762,0.25; 2 -0.762,-0.25; 6 0.762,-0.25; 7 0.762,0.25 | smd 0.25 x 0.275: 3 -0.5,-0.762; 4 0,-0.762; 5 0.5,-0.762; 8 0.5,0.762; 9 0,0.762; 10 -0.5,0.762
USB-C-S = smd 1.1 x 0.3: A5 -1.155,-1.25; A6 -1.155,-0.25; A7 -1.155,0.25; A8 -1.155,1.25; B5 -1.155,1.75; B6 -1.155,0.75; B7 -1.155,-0.75; B8 -1.155,-1.75 | smd 1.05 x 0.6: GND -1.175,3.25; GND2 -1.175,-3.25; VBUS -1.175,2.45; VBUS2 -1.175,-2.45 | smd 2.1 x 1: S@1 -0.53,4.32; S@5 -0.53,-4.32 | smd 2.1 x 1 bottom: S@2 -0.53,4.32; S@6 -0.53,-4.32 | smd 1.6 x 1: S@3 3.65,4.32; S@7 3.65,-4.32 | smd 1.6 x 1 bottom: S@4 3.65,4.32; S@8 3.65,-4.32 | smd 1.5 x 2: S@9 3.6,0 | hole 0.65: 0,-2.89; 0,2.89
SWD-2X5_SMD = smd 1.27 x 0.533: GND@1 -2.413,1.27; GND@2 -2.413,0; GND@3 -2.413,-2.54; NC@1 -2.413,-1.27; NC@2 2.413,-1.27; RST 2.413,-2.54; SWCLK 2.413,1.27; SWDIO 2.413,2.54; SWO 2.413,0; VCC -2.413,2.54
SWD-1X5_SMDNC = smd 2.54 x 1.27: 1-VCC 0,5.08; 2-GND 0,2.54; 3-RST 0,0; 4-SWDCLK 0,-2.54; 5-SWDIO 0,-5.08
JST_SM04B-SRSS-TB = smd 1.5 x 0.6: 1 2.4,1.5; 2 2.4,0.5; 3 2.4,-0.5; 4 2.4,-1.5 | smd 1.8 x 1.2: SHLD1 -1.4,-2.7; SHLD2 -1.4,2.7
C0603' = smd 1 x 0.95: 1 0,0.8; 2 0,-0.8
CUI_CSS-0575A-SMT = smd 2.1 x 1.7: + -1.9,-1.75; - 1.9,-1.75; NC -1.9,1.75
PTS840P = smd 1.65 x 1: 1 -1.9,0.75; 2 1.9,0.75; 3 -1.9,-0.75; 4 1.9,-0.75 | hole 0.7: -2,-0.8; 2,-0.8
C0603T = smd 0.9 x 0.8: C 0,0.75; E 0,-0.75
SOT23 = smd 1.3 x 0.9: 1 -1.1,0.95; 2 -1.1,-0.95; 3 1.1,0
PASSER_07MM = smd 0.7 x 0.7: X 0,0

### Placement (x,y rotation side)
ANT  55.88,69.6 0 top
C1  27.43,27.13 180 top
C2  24.02,31 90 top
C3  30.47,39.5 90 top
C4  30.14,28.22 180 top
C5  34.51,33.18 180 top
C6  36.51,33.18 180 top
C7  35.51,33.18 180 top
C8  29,28.22 180 top
C9  24.63,10.41 270 top
C10  24.12,12.06 270 top
C11  19.12,22.21 90 top
C12  22.47,22.24 270 top
C13  50.59,10.73 270 top
C14  42.76,3.81 90 top
C15  16.81,39.73 270 top
C16  34.14,24.32 180 top
C17  35.22,24.32 180 top
C18  18.99,45.87 0 top
C19  14.74,14.8 180 top
C20  62.44,19.07 90 top
C21  59.23,54.84 90 top
C22  10.24,54.76 270 top
C23  23.55,48.87 180 top
C24  21.58,48.87 180 top
C25  19.87,48.87 180 top
C26  46.87,69.41 90 top
C27  49.12,69.41 270 top
C28  12.03,42.75 180 top
D1  36.89,8.37 90 top
D2  28.16,1.18 270 top
D3  20.37,9.01 0 top
D4  11.37,59 90 top
D5  61.37,59 90 top
D6  61.37,15 270 top
D7  11.37,15 270 top
F1  24.63,8.25 270 top
IC1  29.14,33.74 180 top
IC2  20.46,16.84 90 top
IC3A  53.37,34.5 0 top
IC3B  52.37,35 0 top
IC4  19.37,43.58 0 top
IC5  23.36,62.83 0 top
IC6  48.95,59.78 90 top
IC7A  10.03,43.12 90 top
IC7B  10.12,46.18 90 top
J1  36.39,4.7 270 top
J2  50.17,18.2 0 top
J3  58.27,24.15 180 bottom
J4  13.73,35 0 top
J5  13.73,25.83 0 top
L1  BLM18PG221SH1D  [C0603']  37.75,33.18 180 top
LOGO1  55.09,5.59 0 top
LOGO2  46.55,5.33 0 bottom
LOGO3  68.85,18.77 0 top
LOGO4  49.68,10.57 0 bottom
LOGO5  52.68,5.76 0 bottom
LS1  48.22,6.86 180 top
R1  50.37,14.25 90 top
R2  26.29,27.13 0 top
R3  38.56,8.38 180 top
R4  35.14,8.38 180 top
R5  0  [C0603']  29.8,2.92 90 top
R6  31.64,27.76 90 top
R7  27.38,4.27 0 top
R8  18.08,35.03 180 top
R9  17.29,32.18 270 top
R10  42.76,2.54 90 top
R11  34.78,35.48 90 top
R12  36.43,35.96 180 top
R13  23.33,43.77 180 top
R14  22.03,43.79 180 top
R15  22.01,33.8 90 top
R16  14.42,52.92 0 top
R17  51.98,49.13 0 top
SW1  1.36,54.5 270 top
SW2  71.36,54.5 90 top
T1  43.14,0.99 270 top
T2  46.46,12.62 270 top
X1  5.37,6 0 top
X2  5.37,68 90 top
X3  66.36,68 0 top
X4  66.36,6 0 top

### Tracks (layer width: path | path; a pad name or v marks a point on that pad's centre or on a via)
5V_LED  (via drill 0.3)
  Top 0.203: C21.2 59.71,54.86
  Top 0.406: D3.C 20.37,10.38 20.18,10.57 17.37,10.57 16.19,11.75 16.19,14.67 15.56,15.3 C19.2 12.96,15.3 | 12.96,15.3 8.19,15.3 4.45,19.05 4.45,49.53 9.5,54.59 9.56,54.59 C22.2 9.74,54.87 9.77,54.89 D4.1 9.77,56.64 v10.92,56.64 | D7.1 12.96,15.3 | v59.82,58.42 59.82,56.65 D5.1 59.71,56.55 59.71,54.86 60.45,54.86 61.59,53.72 61.59,21.05 62.94,19.71 C20.2 62.97,19.05 D6.1
  Bottom 0.406: v10.92,56.64 11.3,57.02 11.3,59.82 17.21,65.72 49.97,65.72 57.28,58.42 v59.82,58.42
+3V3  (via drill 0.3)
  Top 0.2: IC1.44 29.89,28.97 C4.2 30.45,28.72 31.14,28.03 R6.1 | v57.89,19.07 57.89,18.3 52.92,13.34 | R14.2 23.3,44.29 R13.2 | 15.24,41.66 13.95,41.66 12.41,43.19 12.08,43.19 | C28.2 11.96,43.18 10.29,43.18 | 10.29,43.18 9.65,43.18 | 9.65,43.18 9.27,43.18 9.06,42.97 IC7A.8 | 9.65,43.18 9.65,43.87 IC7A.2 9.64,43.99 9.64,45.26 9.81,45.42 IC7B.1 9.62,45.42 IC7B.10 | IC7A.6 10.29,42.39 10.29,43.18 | R17.2 50.86,47.5 v47.88,47.5 | IC7B.6 10.37,47.1 10.1,47.37 9.53,47.37
  Top 0.203: 12.08,43.19 C28.2 | 9.53,47.37 9.34,47.37 8.94,46.98 8.94,45.88 9.13,45.68 IC7B.10 | 52.92,13.34 49.87,13.34 | R16.2 17.49,49.34 17.78,49.34 | IC1.36 C2.2 | C2.2 24.52,30.24 24.51,30.23 v24.51,30.16 | 15.81,31.05 15.65,31.21
  Top 0.254: C2.2 | C18.2 20.29,45.37 20.85,44.81 IC4.8 21.99,44.33 R14.2 | R9.2 14.7,32.18 14.67,32.21 14.67,32.19 | 14.61,35.43 16.07,35.43 J4.2 16.2,35.43 17.98,35.43 R8.2 | IC1.17 29.89,37.82 30.97,38.9 C3.2
  Top 0.305: R1.1 49.87,13.34 49.87,10.51 C13.2 | v16.83,31.05 15.81,31.05
  Top 0.406: v31.69,47.43 31.62,47.37 31.62,40.58 30.97,39.92 C3.2 | v20.95,23.62 20.45,23.62 | IC3B.7 51.12,30.1 50.48,29.46 46.36,29.46 | IC3B.19 51.12,40.33 50.42,41.02 48.13,41.02 46.36,39.24 46.36,29.46 | R6.1 31.14,25.74 v31.05,25.65 | C15.2 15.52,39.73 15.24,40.01 | LS1.+ 50.12,10.7 C13.2 | v34.07,25.62 34.1,25.65 34.14,25.61 C16.2 34.2,24.77 34.29,24.77 34.34,24.82 C17.2 36.77,24.82 37.19,24.41 IC3A.1 37.52,24.41 42.57,29.46 46.36,29.46 | v29.72,23.56 30.04,23.56 32.35,21.25 47.62,21.25 | L1.1 37.95,32.58 v38.73,32.58 | R1.1 49.87,19.64 48.26,21.25 47.62,21.25 | J2.VCC 47.62,20.87 47.62,21.25
  Top 0.61: 17.78,49.34 17.91,49.34 | 17.91,49.34 19.84,49.34 C25.2 C24.2 22.96,49.37 22.99,49.4 | IC5.20 17.9,49.35 17.91,49.34 | IC5.23 22.98,49.41 22.99,49.4 | 22.99,49.4 23.02,49.37 C23.2 30.57,49.37 31.75,48.2 31.75,47.5 v31.69,47.43 | IC2.2 IC2.4 20.45,19.94 20.45,22.21 | C11.2 20.45,22.21 | 20.45,22.21 21.5,22.21 C12.2 | 20.45,22.21 20.45,23.62 20.45,26.42 15.65,31.21 14.67,32.19 14.61,32.26 14.61,35.43 14.61,37.91 15.24,38.54 15.24,40.01 15.24,41.66 15.24,43.43 17.17,45.37 17.53,45.37 | 17.53,45.37 C18.2 | 17.53,45.37 17.53,48.96 17.91,49.34 | v48.01,63.37 48.01,67.22 IC6.13 47.95,69.41 47.94,69.41 | C26.2 47.94,69.41 | C27.2 47.94,69.41
  Bottom 0.203: J3.1-VCC v57.89,19.07
  Bottom 0.305: v24.51,30.16 23.62,31.05 v16.83,31.05
  Bottom 0.406: v20.95,23.62 21.02,23.56 v29.72,23.56 29.72,24.51 30.99,25.78 30.99,25.72 v31.05,25.65 | v34.07,25.62 34.04,25.65 v31.05,25.65 | v38.73,32.58 34.73,28.57 33.78,28.57 31.05,25.84 v31.05,25.65
  Bottom 0.61: v31.69,47.43 47.82,47.43 v47.88,47.5 48.01,47.62 v48.01,63.37
+5V  (via drill 0.3)
  Top 0.203: C10.2 23.37,12.06
  Top 0.406: D3.A 20.66,8.25 F1.2 23.68,9.27 | 23.68,9.27 C9.2 23.62,10.46 C10.2 | 23.37,12.06 22.77,12.66 IC2.3 | J5.2 17.15,26.33 17.66,25.82 17.66,23.82 v15.81,21.97 | v22.41,9.27 23.68,9.27
  Bottom 0.406: v15.81,21.97 13.08,19.24 13.08,12.32 16.13,9.27 v22.41,9.27
CC1
  Top 0.203: R4.1 J1.A5
CC2
  Top 0.203: J1.B5 38.14,7.45 R3.1
CFG
  Top 0.2: R16.1 14.55,53.54 14.55,64.52 14.82,64.79 IC5.10
D0_LIGHTSENS  (via drill 0.3)
  Top 0.2: IC1.3 33.03,31.99 | 43.31,3.86 C14.2 R10.2 43.26,1.86 T1.E
  Top 0.203: 43.31,3.86 43.37,3.92 43.37,12.06 43.75,12.45 v43.75,12.64 | 33.03,31.99 33.09,31.99 34.61,30.48 38.93,30.48 v39.24,30.16
  Bottom 0.2: 40.89,28.83 40.89,23.69 44.58,20 44.58,13.21 44.01,12.64 v43.75,12.64
  Bottom 0.203: 40.89,28.83 39.63,30.1 39.31,30.1 v39.24,30.16
D1_LIGHTSENS_PWR  (via drill 0.3)
  Top 0.2: 33.17,32.49 IC1.4
  Top 0.203: T1.C 44.05,0.99 44.05,11.85 44.26,12.06 v44.45,12.06 | v39.31,31.05 39.18,30.92 34.73,30.92 33.17,32.49
  Bottom 0.2: v39.31,31.05 39.37,31.05 41.3,29.12 41.3,23.85 44.98,20.17 44.98,13.62
  Bottom 0.203: v44.45,12.06 44.45,12.32 44.98,12.85 44.98,13.62
D2_SWITCH  (via drill 0.3)
  Top 0.2: IC1.48 32.39,30.34 | 68.72,52.21 70.22,52.21 SW2.1
  Top 0.203: SW2.2 SW2.1 | v65.85,52.21 68.72,52.21 | 32.39,30.34 33.79,30.34 34.19,29.95 38.45,29.95 39,29.4 39.88,29.4 41.72,31.24 44.01,31.24 v44.04,31.21
  Bottom 0.2: v65.85,52.21 62.3,52.21 44.04,33.94 v44.04,31.21
D3_STATUSLED  (via drill 0.3)
  Top 0.203: R7.1 v27.38,5.71 | IC1.39 27.39,28.78 27.05,28.45 25.84,28.45 24.7,27.3 24.7,26.8 v24.19,26.29
  Bottom 0.203: v27.38,5.71 17.78,5.71 11.81,11.68 11.81,20.7 17.53,26.42 24.07,26.42 v24.19,26.29
D4_BUZZER
  Top 0.203: IC1.10 34.26,35.49 R11.1
D5_WS2812
  Top 0.2: IC1.31 25.25,33.49 24.9,33.14 23.6,33.14 22.95,33.8 R15.2
D6_SDA  (via drill 0.3)
  Top 0.2: IC3B.10 54.87,30.16 53.09,28.38
  Top 0.203: IC1.13 v33.4,37.14 | J4.3 18.02,34.5 18.07,34.54 | v20.19,29.78 19.94,30.04 19.94,30.92 18.52,32.34 18.52,34.08 R8.1 | 53.09,28.38 47.72,28.38 44.89,25.55 IC3A.4
  Top 0.254: 18.07,34.54 R8.1
  Bottom 0.2: v20.19,29.78 20.19,29.27 21.25,28.22 28.47,28.22 33.59,33.34 33.59,36.95 v33.4,37.14 33.4,37.85 34.04,38.48 37.78,38.48 42.8,33.46 | IC3A.4 44.19,24.41 42.8,25.8
  Bottom 0.203: 42.8,33.46 42.8,25.8
D7_SCL  (via drill 0.3)
  Top 0.2: 17.92,32.18 19.43,30.67 19.43,29.92 v19.3,29.8 | IC3B.9 53.62,29.61 52.83,28.83
  Top 0.203: IC1.14 31.39,37.67 31.63,37.91 34.16,37.91 v34.29,37.78 | J4.4 17.49,33.5 17.79,33.2 R9.1 17.92,32.18 | 52.83,28.83 47.53,28.83 43.11,24.41 IC3A.3
  Bottom 0.2: v19.3,29.8 19.3,29.48 20.97,27.81 28.64,27.81 34.04,33.21 34.04,37.53 v34.29,37.78 34.42,37.91 37.66,37.91 42.34,33.22 IC3A.3
D8_SDA  (via drill 0.3)
  Top 0.2: IC4.5 20.85,41.97 v20.57,41.97 | 23.37,41.66 21.16,41.66 | 23.37,41.66 24.32,41.66 27.89,38.09 IC1.21 | R13.1 23.32,41.7 23.37,41.66
  Top 0.203: 11.56,44.6 10.88,44.6 10.36,44.08 IC7A.3 | 11.56,44.6 13,44.6 13.85,43.75 13.85,42.86 v14.02,42.69 | 21.16,41.66 20.85,41.97 | IC7B.4 11.48,46.18 11.56,46.1 11.56,44.6
  Bottom 0.2: v14.02,42.69 14.14,42.82 20.05,42.82 20.57,42.29 v20.57,41.97
D9_SCL  (via drill 0.3)
  Top 0.2: IC4.6 21.99,43.33 R14.1 22.03,42.54 v21.91,42.42 | IC1.22 27.39,37.95 24.19,41.15 22.1,41.15 v21.84,40.89 | IC7A.4 11.22,44.13 12.51,44.13 v13.02,43.62
  Top 0.203: IC7B.2 10.37,44.91 10.28,44.83 v10.27,44.83
  Bottom 0.2: v21.84,40.89 21.91,40.89 v21.91,42.42 21.34,42.42 20.32,43.43 13.21,43.43 v13.02,43.62
  Bottom 0.203: v13.02,43.62 11.82,44.83 v10.27,44.83
D10_WINC_EN  (via drill 0.3)
  Top 0.2: 28.87,41.55 28.87,42.83
  Top 0.203: IC1.19 28.87,37.16 28.87,41.55 | v21.97,50.42 v21.96,50.43 IC5.22 | 28.87,42.83 28.87,43.08 v28.57,43.37 | v28.7,46.48 25.46,46.48 25.02,46.04 23.11,46.04 v22.48,46.67
  Bottom 0.203: v22.48,46.67 21.97,47.18 v21.97,50.42 | v28.57,43.37 28.7,43.5 v28.7,46.48
D11_WINC_WAKE  (via drill 0.3)
  Top 0.2: IC5.11 16.08,63.69 v18.35,63.69 | v28.19,42.55 28.39,42.35 IC1.20
  Bottom 0.2: v18.35,63.69 28.07,53.98 28.07,45.86 28.24,45.68 28.24,44.49 27.94,44.19 27.94,42.8 v28.19,42.55
D12_WINC_RST
  Top 0.203: IC5.4 32,57.68 32.42,57.26 32.42,49.74 33.02,49.15 33.02,40.01 30.89,37.87 IC1.15
D13_WINC_IRQ  (via drill 0.3)
  Top 0.2: IC1.29 23.94,34.48 v23.75,34.29
  Top 0.203: IC5.13 17.63,61.74 18.39,60.99 v18.39,60.35
  Bottom 0.2: v23.75,34.29 23.94,34.48 24.76,34.48 26.72,36.43 26.72,41.41 26.16,41.97 26.16,45.35 26.59,45.78 26.59,52.28 18.51,60.35 v18.39,60.35
D14_WINC_CS  (via drill 0.3)
  Top 0.2: v24.64,35.62 24.77,35.49 IC1.27
  Top 0.203: v18.8,59.05 18.45,58.69 IC5.16
  Bottom 0.2: v24.64,35.62 24.76,35.5 25.21,35.5 26.31,36.6 26.31,41.24 25.76,41.8 25.76,45.52 26.12,45.88 26.12,51.73
  Bottom 0.203: 26.12,51.73 v18.8,59.05
D15_WINC_MOSI  (via drill 0.3)
  Top 0.2: IC5.15 17.63,59.71 | 17.63,59.71 19.6,59.71 | 17.63,59.71 v17.65,59.69 | v24.89,36.96 24.89,36.89 25.29,36.49 IC1.25
  Top 0.203: IC6.3 45.95,60.22 40.26,65.91 33.4,65.91 31.98,64.5 31.98,63.04 31.56,62.61 29.65,62.61 28.45,61.4 21.3,61.4 19.6,59.71
  Bottom 0.2: v24.89,36.96 25.65,36.96 25.91,37.21 25.91,41.07 25.35,41.63 25.35,45.68 25.72,46.05 25.72,51.18 17.65,59.24 v17.65,59.69
D16_WINC_SCK  (via drill 0.3)
  Top 0.2: IC1.26 25.17,35.99 24.9,36.26 24.25,36.26 v24.13,36.39
  Top 0.203: IC5.18 16.19,56.47 19.32,56.47 19.37,56.52 v19.43,56.52 20.51,55.44 25.02,55.44 29.91,60.33 32.24,60.33 32.8,60.89 32.8,64.17 33.67,65.04 39.48,65.04 42.8,61.72 42.8,50.67 43.18,50.29 47.5,50.29 47.95,50.74 IC6.4
  Bottom 0.2: v24.13,36.39 24.1,36.36 23.87,36.59 23.87,51.96
  Bottom 0.203: 23.87,51.96 23.87,52.08 v19.43,56.52
D17_WINC_MISO  (via drill 0.3)
  Top 0.2: v17.4,57.72 17.36,57.68 IC5.17 | IC1.28 25.23,34.99 25.22,34.98 23.98,34.98 v23.66,35.31
  Top 0.203: v17.4,57.72 18.43,57.72 21.6,60.89 31.93,60.89 32.39,61.35 32.39,64.33 33.5,65.45 39.88,65.45 43.95,61.37 IC6.2
  Bottom 0.2: v17.4,57.72 17.4,57.59 23.47,51.53 23.47,35.5 v23.66,35.31
D18_WINC_RX  (via drill 0.3)
  Top 0.2: v26.67,29.35 26.89,29.56 IC1.38
  Top 0.203: IC5.14 16.11,60.83 v17.53,60.83
  Bottom 0.2: v26.67,29.35 26.67,29.34 27.52,30.19 27.52,35.53 27.93,35.93 27.93,41.91 27.54,42.3 27.54,44.35 27.84,44.65 27.84,45.52 27.54,45.82 27.54,52.58
  Bottom 0.203: v17.53,60.83 17.72,61.02 17.72,61.05 18.71,61.05 25.14,54.62 26.55,54.62 27.54,53.63 27.54,52.58
D19_WINC_TX  (via drill 0.3)
  Top 0.2: v25.78,29.34 25.78,29.36 26.4,29.98 26.4,30.32 IC1.37
  Top 0.203: IC5.19 19.62,55.65 20.31,54.95 24.99,54.95 v25.97,53.98
  Bottom 0.2: v25.78,29.34 25.78,29.36 27.12,30.7 27.12,35.7 27.52,36.1 27.52,41.74 27.13,42.13 27.13,44.52 27.43,44.82 27.43,45.35 27.07,45.71 27.07,52.88
  Bottom 0.203: v25.97,53.98 v25.97,53.97 27.07,52.88
D20_LORA_CS  (via drill 0.3)
  Top 0.2: IC1.30 24.92,33.99 24.71,33.78 v24.51,33.78 | v29.65,45.4 29.34,45.09 v26.8,45.09 | 48.39,48.77 49.95,50.33 IC6.5
  Top 0.203: v34.93,45.47 40.13,45.47 43.43,48.77 48.39,48.77
  Bottom 0.2: v34.93,45.47 34.86,45.4 v29.65,45.4 | v24.51,33.78 24.63,33.78 27.12,36.27 27.12,41.58 26.73,41.97 26.73,45.09 v26.8,45.09
D21_LORA_DIO0  (via drill 0.3)
  Top 0.203: IC6.14 45.95,64.3 v45.85,64.2 | IC1.23 26.82,37.21 26.82,37.65 24.97,39.5 v24.64,39.5 | v29.97,47.37 29.78,47.18 24.82,47.18 v24.51,46.86
  Bottom 0.203: v45.85,64.2 44.45,62.8 44.45,51.94 41.08,48.58 30.86,48.58 29.97,47.69 v29.97,47.37 | v24.51,46.86 24.57,46.81 24.54,46.78 24.54,39.59 v24.64,39.5
D22_LORA_DIO1  (via drill 0.3)
  Top 0.203: IC6.15 v43.95,64.21 v43.94,64.2 | IC1.24 25.3,38.23 v25.27,38.23 | v29.15,48.07 29.08,48.07 28.89,47.88 25.15,47.88 v25.02,48.01
  Bottom 0.203: v43.94,64.2 43.94,52.2 40.83,49.09 30.67,49.09 29.65,48.07 v29.15,48.07 | v25.02,48.01 25.21,47.82 25.21,46.11 24.95,45.85 24.95,41.36 25.28,41.03 25.28,39.23 25.27,39.23 v25.27,38.23
GND  (via drill 0.3)
  Top 0.152: IC7B.3 10.73,45.68 10.22,46.19 10.13,46.19 10.12,46.2 10.28,46.2 10.64,46.56 10.76,46.56 IC7B.5
  Top 0.2: IC1.35 26.89,31.5 IC1.TP | IC1.42 28.89,33.49 IC1.TP | IC1.18 29.39,34.85 29.14,34.6 29.14,33.78 | 29.14,33.78 IC1.TP | IC1.5 29.93,32.99 29.14,33.78 | J1.GND 39.64,6.49 40.26,7.11
  Top 0.203: SW1.3 1.11,56.49 0.64,56.52
  Top 0.305: 72.13,57.78 72.13,51.44 | 0.64,57.66 0.64,56.52 0.64,51.31
  other vias: 16.64,3.56 35.12,9.84 38.54,9.84 36.83,9.84 30.86,6.86 41.91,6.48 37.47,4.19 16.64,37.85 14.73,28.19 8.51,10.73 17.91,41.59 18.8,47.62 30.1,40.89 28.45,34.42 29.72,34.42 28.45,33.02 29.72,33.02 35.88,31.69 35.05,36.58 53.98,69.34 47.5,71.37 45.34,69.47 55.88,50.04 58.04,53.85 24.26,59.56 17.84,62.67 12.95,59.05 7.49,54.74 40.51,52.32 62.99,63.5 60.45,21.72 69.98,14.48 22.67,16 15.49,19.56 18.29,16 23.49,20.57 18.54,23.37 26.92,9.4 25.08,17.72 27.3,25.65 29.53,26.67 29.08,51.56 19.56,51.94 28.26,67.31 36.07,68.58 20.57,32.64 13.46,36.32 71.36,54.99 16.64,53.28 17.78,67.31 21.59,59.31 22.73,58.17 24,56.9 18.8,57.15 60.45,4.7 51.18,2.41 3.17,15.24 2.03,24.26 1.59,48.26 3.75,62.48 38.8,71.18 61.72,68.96 70.61,60.33 70.23,24.26 70.61,47.62 31.18,9.46 47.94,39.37 48.32,30.92 23.49,67.31 8.83,64.39 2.48,66.29 54.17,71.12 55.88,71.37 57.59,71.18 57.79,69.34 57.79,67.44 57.79,65.53 56.52,64.9 54.86,65.21 23.49,64.77 19.68,64.77 27.94,64.77 26.67,59.05 31.75,59.05 27.94,56.52 11.56,52.64 7.11,29.97 3.49,35.05 50.42,62.67 41.53,60.77 55.5,56.32 50.42,55.69 59.05,41.78 42.8,43.05 7.3,21.27 22.35,4.19 6.48,37.59 34.23,27.05 37.66,36.45 28.26,21.53 30.61,12.95 41.4,12.51 25.02,13.84 23.37,29.4 28,16.45 21.27,37.34 14.22,40.96 14.41,44.32 67.69,35.05 35.81,40.51 22.03,45.47 22.03,24.64 48.2,11.87 52.13,14.48 55.37,18.16 53.59,22.42 55.69,9.14 44.7,27.81 57.91,30.86 40.64,31.69 50.74,36.64 54.04,36.64 50.67,33.27 54.04,33.27 46.86,57.91 41.66,55.94 53.15,26.86 31.5,24.26 48.96,18.8 43.43,35.43
  pour Top: 0.36,0 72.33,0 72.36,0.03 72.36,72 37.37,72 33.37,68 0.36,68
  pour Bottom: 0.36,0 72.33,0 72.36,0.03 72.36,72 37.37,72 33.37,68 0.36,68
N$1
  Top 0.305: T2.3 46.32,11.37 LS1.-
N$2  (via drill 0.3)
  Top 0.2: v46.1,15.49 47.41,14.19 T2.1 | R11.2 35.29,35.46 R12.1 38.07,35.46 40.89,32.64 v45.09,32.64
  Bottom 0.2: v45.09,32.64 46.1,31.62 v46.1,15.49
N$3
  Top 0.2: R7.2 27.41,3.74 D2.A
N$4
  Top 0.406: ANT.1 55.88,67.35 IC6.9
N$6
  Top 0.203: R17.1 51.98,52.24 IC6.6
N$8  (via drill 0.3)
  Top 0.2: v2.56,29.84 2.6,29.89 2.6,52.11 SW1.2 SW1.1
  Top 0.203: R2.2 25.47,26.63 v25.42,26.59
  Bottom 0.2: v25.42,26.59 25.04,26.97 5.43,26.97 v2.56,29.84
RST  (via drill 0.3)
  Top 0.2: v59.05,24 58.93,23.88 58.93,23.42 | 50.87,15.66 J2.RST | 50.87,15.66 | R1.2 50.87,15.66 | R2.1 C1.2 | IC1.40 27.89,28.41 27.43,27.95 C1.2 | C1.2 27.55,27.63 | 50.87,15.66 50.87,19.87 48.79,21.95 32.66,21.95 31.56,23.05
  Top 0.203: 31.56,23.05 28.45,26.16 28.45,26.73 27.55,27.63 | 58.93,23.42 55.26,19.75 54.48,19.75 53.78,19.05 53.78,16.07 53.4,15.68 52.61,15.68 J2.RST
  Bottom 0.2: v59.05,24 58.41,24 J3.3-RST
SHLD  (4 unrouted)
  Top 0.203: 37.07,1.05 37.02,1.1 J1.S@9 35.61,1.1 35.56,1.05
  Top 0.406: 37.07,1.05 J1.S@3 J1.S@1 | J1.S@9 | 36,1.05 35.56,1.05 J1.S@7 32.07,2.86 32,2.92 | 32,2.92 R5.2 | J1.S@6 32.07,2.98 32,2.92
SWCLK  (via drill 0.3)
  Top 0.2: 58.27,23.41 J3.4-SWDCLK | IC1.45 30.39,29.75 30.99,29.15 31.18,29.15 32.14,28.19 R6.2 32.26,27.64 32.26,23.18 33.08,22.35 49.15,22.35 52.07,19.43 52.55,19.43 J2.SWCLK
  Top 0.203: J2.SWCLK 53.44,19.47 54.23,20.26 55.12,20.26 58.27,23.41
  other vias: 58.27,26.69
SWDIO  (via drill 0.3)
  Top 0.2: v57.53,29.08 57.53,23.3 54.97,20.74 J2.SWDIO 52.55,20.7 51.56,20.7 49.51,22.75 33.38,22.75 32.83,23.3 32.83,28.19 31.38,29.64 31.15,29.64 30.95,29.84 30.95,30.27 IC1.46
  Bottom 0.2: v57.53,29.08 58.13,29.08 J3.5-SWDIO
USB_N
  Top 0.203: J1.A7 36.64,6.99 | 36.64,7.67 36.64,6.99 | 36.64,6.99 36.6,6.99 36.58,6.96 36.53,7 36,7 35.64,6.64 J1.B7 | IC1.33 25.15,32.49 25.08,32.42 23.18,32.42 arc90 21.87,31.11 21.87,27.66 arc90 24.76,24.77 arc-90 26.26,23.27 26.26,15.65 arc90 30.48,11.43 35.43,11.43 arc-90 36.11,10.76 36.11,9.61 36.32,9.4 36.32,8.49 36.64,8.18 36.64,7.67 | D1.1 36.64,7.67
USB_P
  Top 0.203: 37.14,7.67 J1.B6 37.14,5.14 36.95,4.95 36.32,4.95 36.14,5.14 J1.A6 | 37.14,7.67 D1.2 | IC1.34 25.16,31.99 25.08,32.07 23.18,32.07 arc90 22.22,31.11 22.22,27.66 arc90 24.76,25.12 arc-90 26.67,23.22 26.67,15.65 arc90 30.48,11.84 35.81,11.84 arc-90 37.54,10.11 37.54,9.54 37.4,9.4 37.4,8.44 37.14,8.18 37.14,7.67
VBUS  (via drill 0.3)
  Top 0.406: J1.VBUS 38.84,6.83 v39.88,7.87 | v27.05,8.13 25.7,8.13 F1.1 | J1.VBUS2 33.94,7.85 v33.91,7.87
  Bottom 0.406: v27.05,8.13 27.3,7.87 v33.91,7.87 v39.88,7.87
VCCANA
  Top 0.203: IC1.6 34.33,33.49 C5.2 C7.2 C6.2 37.45,33.68 L1.2
VCCCORE
  Top 0.2: IC1.43 29.39,29.1 C8.2
W1IN  (via drill 0.3)
  Top 0.203: R15.1 21.51,34.05 21.59,34.13 v21.59,34.92 | D4.4 v8.57,61.4
  Bottom 0.203: v8.57,61.4 8.57,59.05 4.51,54.99 4.51,36.83 6.35,34.99 21.53,34.99 v21.59,34.92
W1OUT  (via drill 0.3)
  Top 0.203: D5.4 59.44,61.72 v58.42,61.72 | v11.38,62.89 11.38,58.47 13.34,56.52 13.05,56.52 D4.2
  Bottom 0.203: v58.42,61.72 54.93,61.72 50.29,66.36 16.85,66.36 13.38,62.89 v11.38,62.89
W2OUT
  Top 0.203: D5.2 62.97,21.49 64.52,19.94 64.52,14.15 D6.4
W3OUT  (via drill 0.3)
  Top 0.2: v14.61,12.64 13,12.64 D7.4
  Top 0.203: D6.2 59.77,16.27 59.37,15.88 v58.42,15.88
  Bottom 0.2: 16.62,10.56 14.61,12.57 v14.61,12.64
  Bottom 0.203: 16.62,10.56 53.1,10.56 v58.42,15.88
W4OUT
  Top 0.254: J5.3 11.48,25.33 9.77,23.61 D7.2

### Text on the board
tPlace: 1 | 2 | Reset | Switch | I2C | 1=GND / 2=3V3 / 3=SDA / 4=SCL | CO2 Ampel | CO2 Ampel | WS2812 | 1=GND / 2=5V / 3=OUT / 4=NC | 4 | 3 | Status | v1.2 | www.watterott.com
bPlace: CO2 Ampel | www.watterott.com | DIO / CLK / RST / GND / 3V3
Reference: Silkscreen: 21 tPlace + 22 bPlace